# Altium schematic sheet NEB_PCIO.SchDoc
size A4; Organization: Altium Limited; Address1: L3, 12a Rodborough Rd; Address2: Frenchs Forest; Address3: NSW; Address4: Australia 2086; DocumentNumber: 9; SheetNumber: 9; SheetTotal: 10
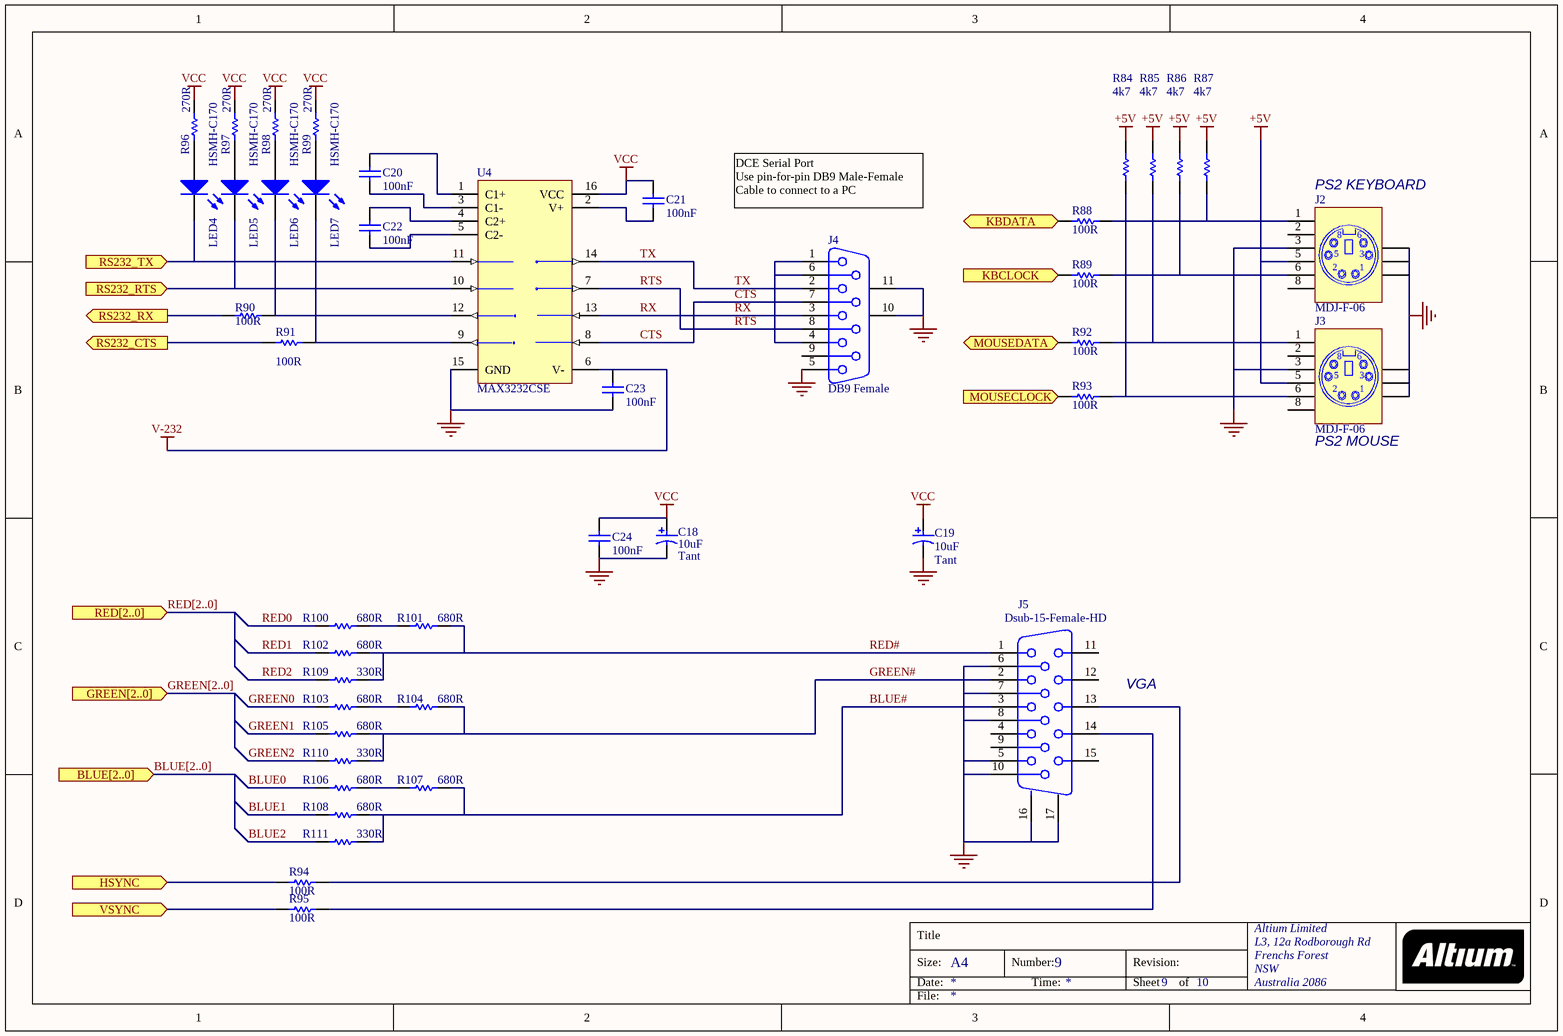
[diagram p0: NEB_PCIO.SchDoc]

## Parts
C18  10uF  Capacitor Type: Tant  [MCCT-B]
C19  10uF  Capacitor Type: Tant  [MCCT-B]
C20  100nF  [CC2012-0805]
C21  100nF  [CC2012-0805]
C22  100nF  [CC2012-0805]
C23  100nF  [CC2012-0805]
C24  100nF  [CC2012-0805]
J2  MDJ-F-06  [MDJ-F-06]
J3  MDJ-F-06  [MDJ-F-06]
J4  DB9 Female  [DSUB1.385-2H9]
J5  Dsub-15-Female-HD  [DB15-VGA-Female]
LED4  HSMH-C170  [SMD _LED]
LED5  HSMH-C170  [SMD _LED]
LED6  HSMH-C170  [SMD _LED]
LED7  HSMH-C170  [SMD _LED]
R84  4k7  [CR2012-0805]
R85  4k7  [CR2012-0805]
R86  4k7  [CR2012-0805]
R87  4k7  [CR2012-0805]
R88  100R  [CR2012-0805]
R89  100R  [CR2012-0805]
R90  100R  [CR2012-0805]
R91  100R  [CR2012-0805]
R92  100R  [CR2012-0805]
R93  100R  [CR2012-0805]
R94  100R  [CR2012-0805]
R95  100R  [CR2012-0805]
R96  270R  [CR2012-0805]
R97  270R  [CR2012-0805]
R98  270R  [CR2012-0805]
R99  270R  [CR2012-0805]
R100  680R  [CR2012-0805]
R101  680R  [CR2012-0805]
R102  680R  [CR2012-0805]
R103  680R  [CR2012-0805]
R104  680R  [CR2012-0805]
R105  680R  [CR2012-0805]
R106  680R  [CR2012-0805]
R107  680R  [CR2012-0805]
R108  680R  [CR2012-0805]
R109  330R  [CR2012-0805]
R110  330R  [CR2012-0805]
R111  330R  [CR2012-0805]
U4  MAX3232CSE  [TSSO5x6-G16]

## Ports
BLUE[2..0] (in), GREEN[2..0] (in), HSYNC (in), KBCLOCK (in), KBDATA (bidir), MOUSECLOCK (in), MOUSEDATA (bidir), RED[2..0] (in), RS232_CTS (out), RS232_RTS (in), RS232_RX (out), RS232_TX (in), VSYNC (in)

## Nets
+5V: J2.5 J3.5 R84.1 R85.1 R86.1 R87.1
GND: C18.2 C19.2 C23.2 C24.2 J2.3 J2.MH1 J2.MH2 J2.MH3 J3.3 J3.MH1 J3.MH2 J3.MH3 J4.5 J4.10(MH1) J4.11(MH2) J5.5 J5.6 J5.7 J5.8 J5.10 J5.16(MH1) J5.17(MH2) U4.15(GND)
V-232: C23.1 U4.6(V-)
VCC: C18.1 C19.1 C21.1 C24.1 R96.2 R97.2 R98.2 R99.2 U4.16(VCC)
BLUE0: R106.1
BLUE1: R108.1
BLUE2: R111.1
BLUE#: J5.3 R107.2 R108.2 R111.2
CTS: J4.7 U4.8(R2IN)
GREEN0: R103.1
GREEN1: R105.1
GREEN2: R110.1
GREEN#: J5.2 R104.2 R105.2 R110.2
HSYNC: R94.1 ; port HSYNC
KBCLOCK: R89.1 ; port KBCLOCK
KBDATA: R88.1 ; port KBDATA
MOUSECLOCK: R93.1 ; port MOUSECLOCK
MOUSEDATA: R92.1 ; port MOUSEDATA
RED0: R100.1
RED1: R102.1
RED2: R109.1
RED#: J5.1 R101.2 R102.2 R109.2
RS232_CTS: R91.1 ; port RS232_CTS
RS232_RTS: LED5.2(K) U4.10(T2IN) ; port RS232_RTS
RS232_RX: R90.1 ; port RS232_RX
RS232_TX: LED4.2(K) U4.11(T1IN) ; port RS232_TX
RTS: J4.8 U4.7(T2OUT)
RX: J4.3 U4.13(R1IN)
TX: J4.2 U4.14(T1OUT)
VSYNC: R95.1 ; port VSYNC
NetC20_1: C20.1 U4.1(C1+)
NetC20_2: C20.2 U4.3(C1-)
NetC21_2: C21.2 U4.2(V+)
NetC22_1: C22.1 U4.4(C2+)
NetC22_2: C22.2 U4.5(C2-)
NetJ2_1: J2.1 R87.2 R88.2
NetJ2_6: J2.6 R86.2 R89.2
NetJ3_1: J3.1 R85.2 R92.2
NetJ3_6: J3.6 R84.2 R93.2
NetJ4_1: J4.1 J4.4 J4.6
NetJ5_13: J5.13 R94.2
NetJ5_14: J5.14 R95.2
NetLED4_1: LED4.1(A) R96.1
NetLED5_1: LED5.1(A) R97.1
NetLED6_1: LED6.1(A) R98.1
NetLED6_2: LED6.2(K) R90.2 U4.12(R1OUT)
NetLED7_1: LED7.1(A) R99.1
NetLED7_2: LED7.2(K) R91.2 U4.9(R2OUT)
NetR100_2: R100.2 R101.1
NetR103_2: R103.2 R104.1
NetR106_2: R106.2 R107.1

Not connected (* = marked no-connect by the designer): J2 2 8; J3 2 8; J4 9; J5 4 9 11 12 15

## Buses and harness runs
bus BLUE[2..0] = port BLUE[2..0]
bus GREEN[2..0] = port GREEN[2..0]
bus RED[2..0] = port RED[2..0]

## Notes on the sheet
- DCE Serial Port
  Use pin-for-pin DB9 Male-Female
  Cable to connect to a PC
- (near J2) PS2 KEYBOARD
- (near J3) PS2 MOUSE
- VGA
- Title
- Size:
- Date:
- A4
- Number:
- Time:
- Revision:
- Sheet
- of
- File:

## Library data of the parts
C18 C19 = CAP_POLAR: Polar Capacitor; Fitted: True; Supplier: FARNELL; Supplier Code: 967-117
C20-C24 = CAP: Capacitor; Fitted: True; Supplier: FARNELL; Supplier Code: 755-552
J2 J3 = MDJ-F-06: Circular DIN, 6 Postion, Jack, Pitch 2.1/2.6 mm; PCB Layout: Complies with manufacturer's recommendation.; Drill Size: Corresponds to nominal value.; Published: 26-Aug-2004; Package Reference: MDJ-F-06; Publisher: Altium Limited
J4 = D Connector 9: Receptacle Assembly, 9 Position, Right Angle; Manufacturer: Generic Components; Package Information: Latest Revision: O; Positions: 9; Fitted: True; Published: 15-Jun-2001; Revision: July-2002: Re-released for DXP Platform.; Datasheet: (1-Sep-1999); Package Reference: 788750; Publisher: Altium Limited; Class I: Connector; Orientation: Right Angle; Gender: Receptacle
J5 = Dsub-15-Female-HD: Dsub-15 High density VGA Female connetor; Manufacturer: Generic Components; Package Information: Latest Revision: E; Class I: Connector; Positions: 30; Gender: Receptacle Header; Fitted: True; Published: 15-Jun-2001; Revision: July-2002: Re-released for DXP Platform.; Datasheet: (31-Oct-1991); Package Reference: 174213; Publisher: Altium Limited; Orientation: Right Angle
LED4-LED7 = HSMX-C670: Typical RED GaAs SMD LED Agilent make; Manufacturer: Generic Components; Class I: Optoelectronic; Fitted: True; Published: 8-Jun-2000; Revision: July-2002: Re-released for DXP Platform.; Publisher: Altium Limited; Class II: LED
R84-R111 = RES: Resistor; Fitted: True
U4 = MAX3232EUE: 3.0V TO 5.5V, Low-Power, up to 1Mbps, True RS-232 Transceiver Using Four 0.1µF External Capacitor; Manufacturer: Maxim,ST; Package Information: Latest Revision: 21-0066 C; Class I: Communication; Published: 16-Jan-2001; Revision: July-2002: Re-released for DXP Platform.; Datasheet: Latest Revision: Mar-1999; Package Reference: TSSOP16; Publisher: Altium Limited; Class II: Transceiver; Fitted: True